# EAGLE design DE0_Expansion (EAGLE 6.5.0)
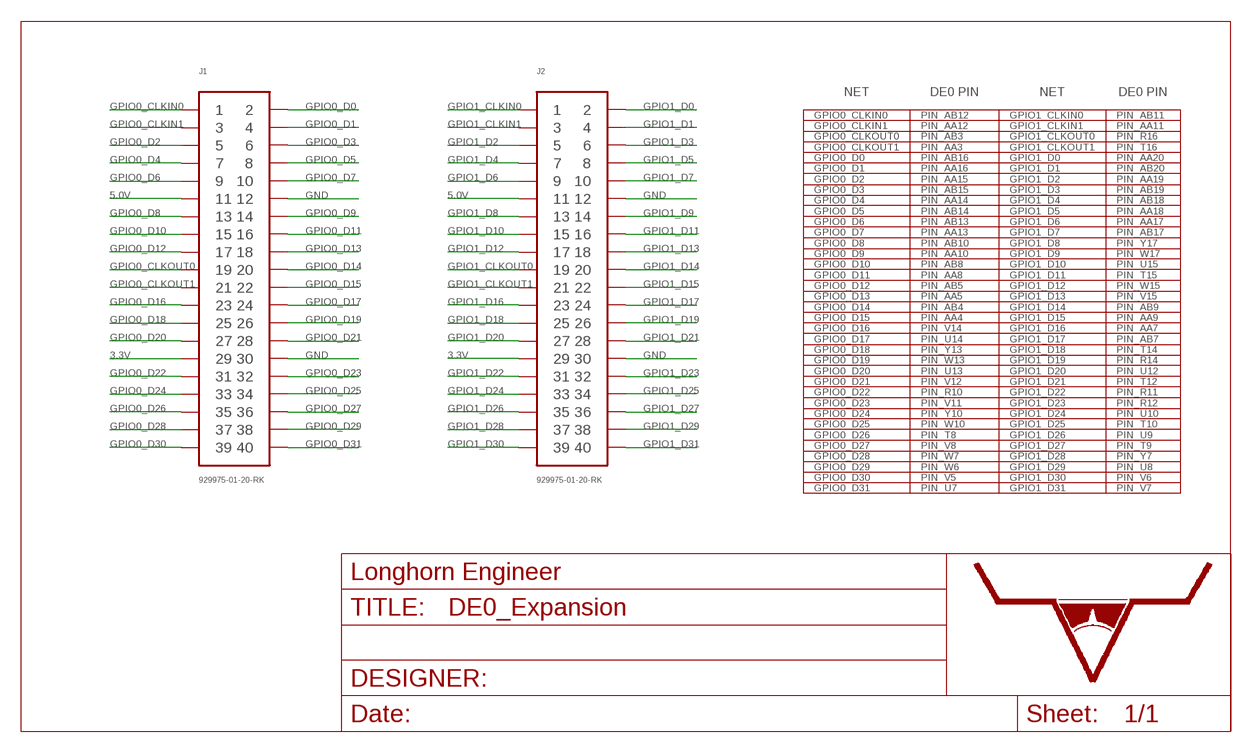
[diagram p0: schematic, sheet 1]

## Parts
FRAME  LHE_FRAME  [LHE_FRAME]
J1  929975-01-20-RK  PH_2X20HEADER_02X20_PTH  [HEADER_02X20_PTH]
J2  929975-01-20-RK  PH_2X20HEADER_02X20_PTH  [HEADER_02X20_PTH]

## Nets
3.3V: J1.29 J2.29
5.0V: J1.11 J2.11
GND: J1.12 J1.30 J2.12 J2.30
GPIO0_CLKIN0: J1.1
GPIO0_CLKIN1: J1.3
GPIO0_CLKOUT0: J1.19
GPIO0_CLKOUT1: J1.21
GPIO0_D0: J1.2
GPIO0_D1: J1.4
GPIO0_D2: J1.5
GPIO0_D3: J1.6
GPIO0_D4: J1.7
GPIO0_D5: J1.8
GPIO0_D6: J1.9
GPIO0_D7: J1.10
GPIO0_D8: J1.13
GPIO0_D9: J1.14
GPIO0_D10: J1.15
GPIO0_D11: J1.16
GPIO0_D12: J1.17
GPIO0_D13: J1.18
GPIO0_D14: J1.20
GPIO0_D15: J1.22
GPIO0_D16: J1.23
GPIO0_D17: J1.24
GPIO0_D18: J1.25
GPIO0_D19: J1.26
GPIO0_D20: J1.27
GPIO0_D21: J1.28
GPIO0_D22: J1.31
GPIO0_D23: J1.32
GPIO0_D24: J1.33
GPIO0_D25: J1.34
GPIO0_D26: J1.35
GPIO0_D27: J1.36
GPIO0_D28: J1.37
GPIO0_D29: J1.38
GPIO0_D30: J1.39
GPIO0_D31: J1.40
GPIO1_CLKIN0: J2.1
GPIO1_CLKIN1: J2.3
GPIO1_CLKOUT0: J2.19
GPIO1_CLKOUT1: J2.21
GPIO1_D0: J2.2
GPIO1_D1: J2.4
GPIO1_D2: J2.5
GPIO1_D3: J2.6
GPIO1_D4: J2.7
GPIO1_D5: J2.8
GPIO1_D6: J2.9
GPIO1_D7: J2.10
GPIO1_D8: J2.13
GPIO1_D9: J2.14
GPIO1_D10: J2.15
GPIO1_D11: J2.16
GPIO1_D12: J2.17
GPIO1_D13: J2.18
GPIO1_D14: J2.20
GPIO1_D15: J2.22
GPIO1_D16: J2.23
GPIO1_D17: J2.24
GPIO1_D18: J2.25
GPIO1_D19: J2.26
GPIO1_D20: J2.27
GPIO1_D21: J2.28
GPIO1_D22: J2.31
GPIO1_D23: J2.32
GPIO1_D24: J2.33
GPIO1_D25: J2.34
GPIO1_D26: J2.35
GPIO1_D27: J2.36
GPIO1_D28: J2.37
GPIO1_D29: J2.38
GPIO1_D30: J2.39
GPIO1_D31: J2.40

## Notes on the sheet
- NET | DE0 PIN | NET | DE0 PIN
- GPIO0_CLKIN0
  GPIO0_CLKIN1
  GPIO0_CLKOUT0
  GPIO0_CLKOUT1
  GPIO0_D0
  GPIO0_D1
  GPIO0_D2
  GPIO0_D3
  GPIO0_D4
  GPIO0_D5
  GPIO0_D6
  GPIO0_D7
  GPIO0_D8
  GPIO0_D9
  GPIO0_D10
  GPIO0_D11
  GPIO0_D12
  GPIO0_D13
  GPIO0_D14
  GPIO0_D15
  GPIO0_D16
  GPIO0_D17
  GPIO0_D18
  GPIO0_D19
  GPIO0_D20
  GPIO0_D21
  GPIO0_D22
  GPIO0_D23
  GPIO0_D24
  GPIO0_D25
  GPIO0_D26
  GPIO0_D27
  GPIO0_D28
  GPIO0_D29
  GPIO0_D30
  GPIO0_D31
- PIN_AB12
  PIN_AA12
  PIN_AB3
  PIN_AA3
  PIN_AB16
  PIN_AA16
  PIN_AA15
  PIN_AB15
  PIN_AA14
  PIN_AB14
  PIN_AB13
  PIN_AA13
  PIN_AB10
  PIN_AA10
  PIN_AB8
  PIN_AA8
  PIN_AB5
  PIN_AA5
  PIN_AB4
  PIN_AA4
  PIN_V14
  PIN_U14
  PIN_Y13
  PIN_W13
  PIN_U13
  PIN_V12
  PIN_R10
  PIN_V11
  PIN_Y10
  PIN_W10
  PIN_T8
  PIN_V8
  PIN_W7
  PIN_W6
  PIN_V5
  PIN_U7
- GPIO1_CLKIN0
  GPIO1_CLKIN1
  GPIO1_CLKOUT0
  GPIO1_CLKOUT1
  GPIO1_D0
  GPIO1_D1
  GPIO1_D2
  GPIO1_D3
  GPIO1_D4
  GPIO1_D5
  GPIO1_D6
  GPIO1_D7
  GPIO1_D8
  GPIO1_D9
  GPIO1_D10
  GPIO1_D11
  GPIO1_D12
  GPIO1_D13
  GPIO1_D14
  GPIO1_D15
  GPIO1_D16
  GPIO1_D17
  GPIO1_D18
  GPIO1_D19
  GPIO1_D20
  GPIO1_D21
  GPIO1_D22
  GPIO1_D23
  GPIO1_D24
  GPIO1_D25
  GPIO1_D26
  GPIO1_D27
  GPIO1_D28
  GPIO1_D29
  GPIO1_D30
  GPIO1_D31
- PIN_AB11
  PIN_AA11
  PIN_R16
  PIN_T16
  PIN_AA20
  PIN_AB20
  PIN_AA19
  PIN_AB19
  PIN_AB18
  PIN_AA18
  PIN_AA17
  PIN_AB17
  PIN_Y17
  PIN_W17
  PIN_U15
  PIN_T15
  PIN_W15
  PIN_V15
  PIN_AB9
  PIN_AA9
  PIN_AA7
  PIN_AB7
  PIN_T14
  PIN_R14
  PIN_U12
  PIN_T12
  PIN_R11
  PIN_R12
  PIN_U10
  PIN_T10
  PIN_U9
  PIN_T9
  PIN_Y7
  PIN_U8
  PIN_V6
  PIN_V7

## Library data of the parts
FRAME = PP_Aesthetics:LHE_FRAME; DNAME: Parker Dillmann; REVNUM: REV: 0
J1 J2 = PP_Connectors:PH_2X20

## Board
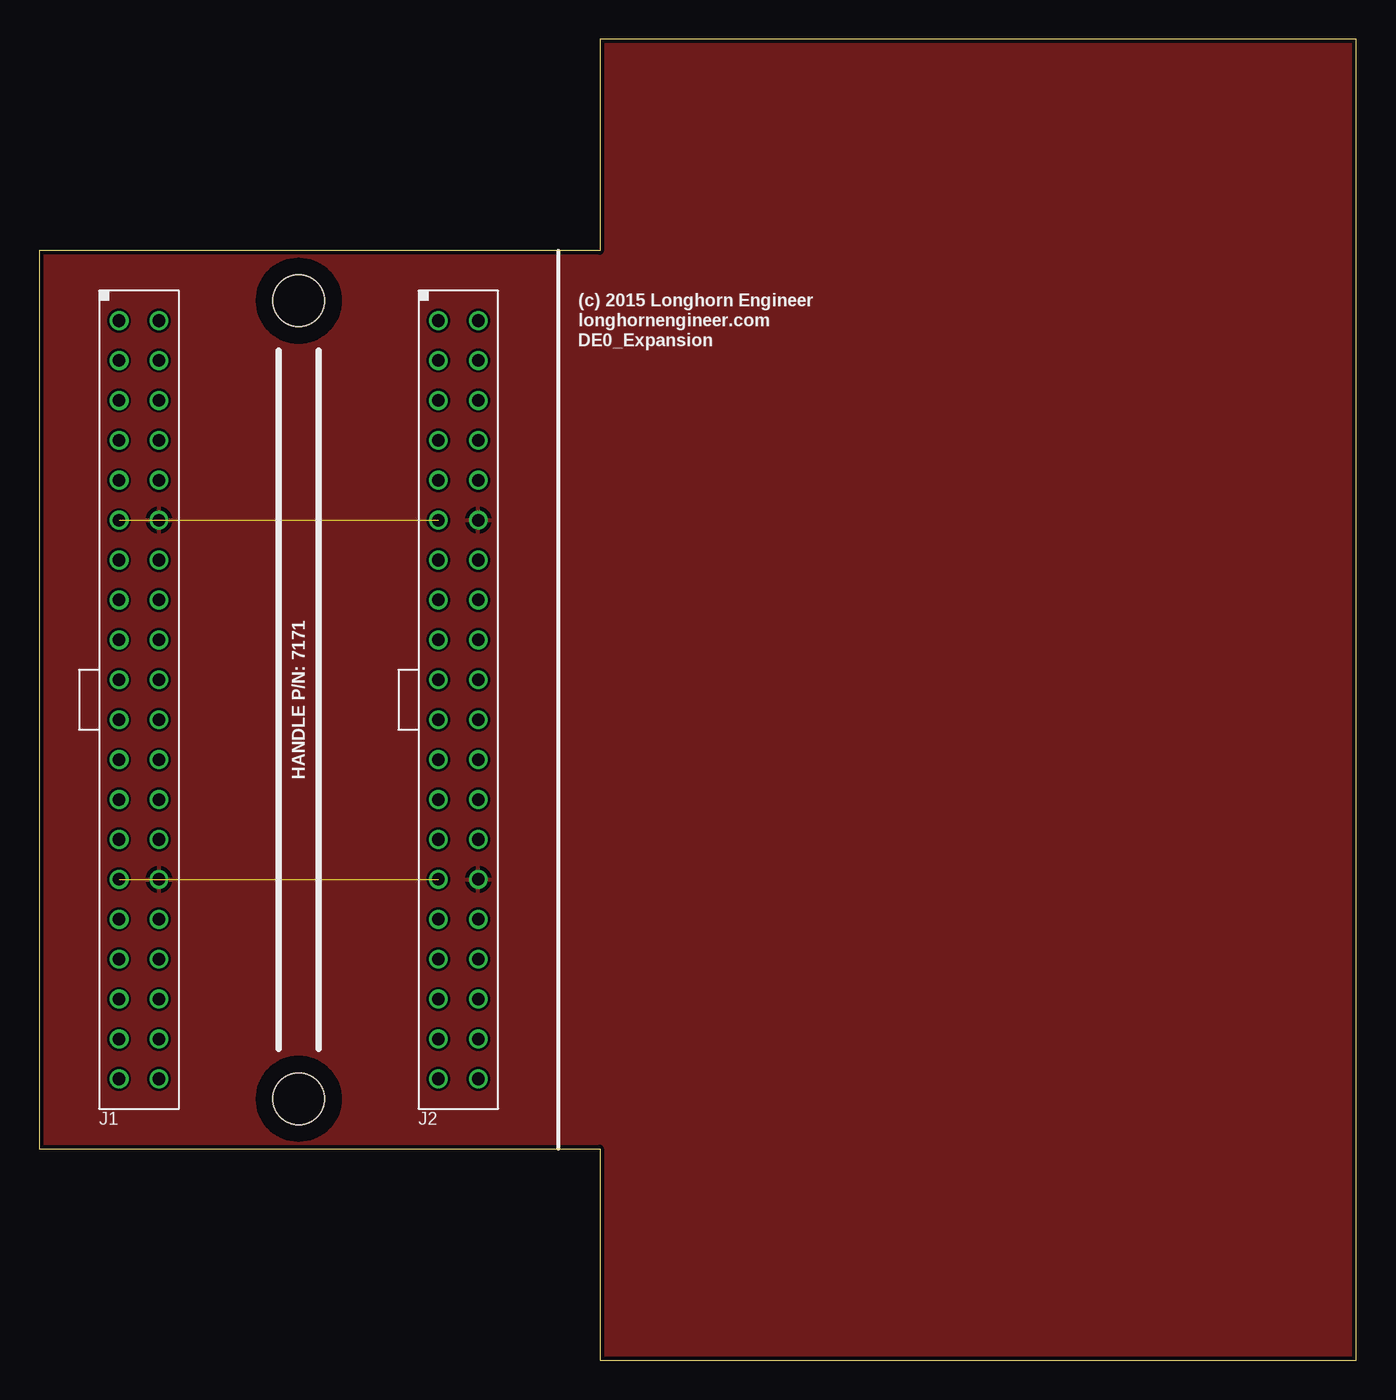
[diagram p1: board, top side]
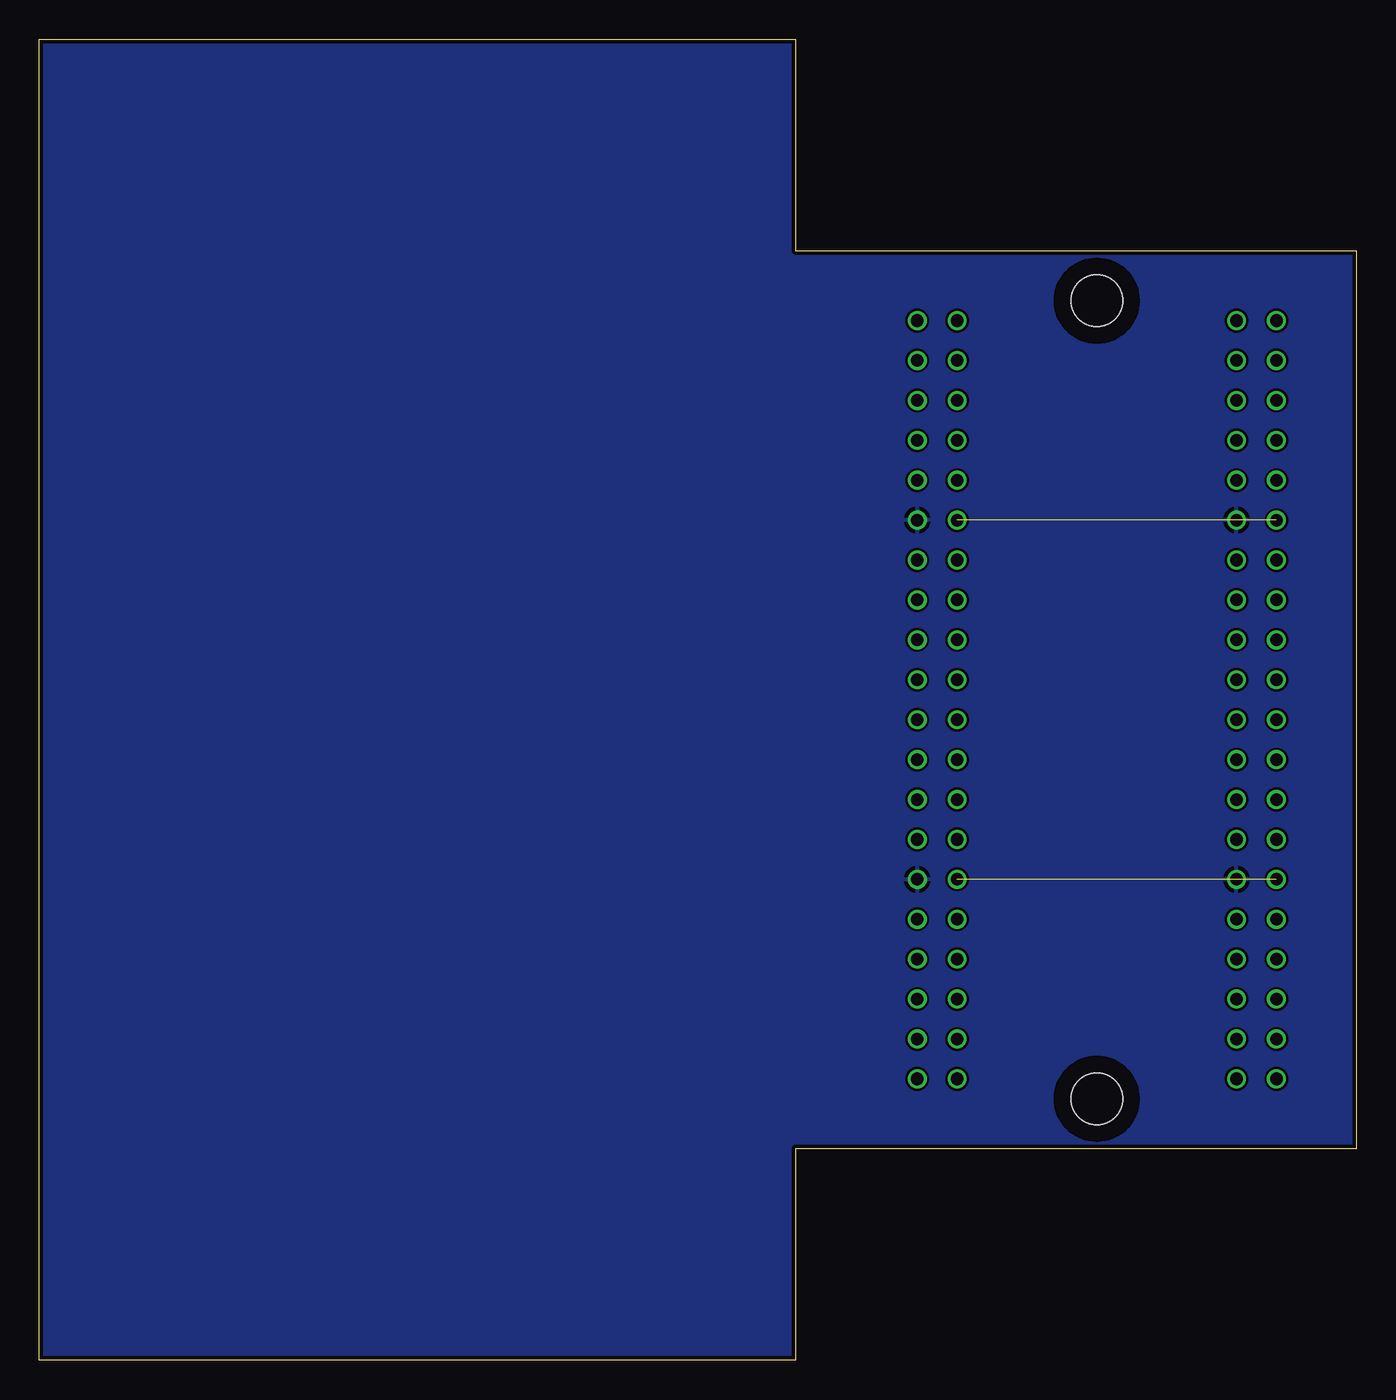
[diagram p2: board, bottom side, seen from below]

Size 83.82 x 84.07 mm. Coordinates in mm from the lower left corner, seen from the top.
Outline: 0,13.46 35.69,13.46 35.69,0 83.82,0 83.82,84.07 35.69,84.07 35.69,70.61 0,70.61 0,13.46
Copper layers (1*16): Top 0.035mm / dielectric 0.2mm / Bottom 0.035mm
Design rules "Seeed_2_Layer_DRU": minimum track width 6mil, minimum drill 12mil, track to track 6mil, track to pad 6mil, pad to pad 6mil, via to via 6mil, smd to smd 0mil, copper to edge 10mil, drill to drill 10mil, minimum pad ring 6mil, minimum via ring 6mil, stop-mask expansion 2mil, vias tented up to drill 25mil, thermal gap 10mil
Holes 3.26 mm at 16.51,67.44 16.51,16.64
tRestrict: area 14,14.1 to 19.1,19.2; area 14,64.9 to 19.1,70
bRestrict: area 14,64.9 to 19.1,70; area 14,14.1 to 19.1,19.2

### Footprints (pad centres in the part's own frame; a part is rotated, then mirrored left to right if it is on the bottom)
HEADER_02X20_PTH = drill 0.8: 1 -1.27,24.13; 2 1.27,24.13; 3 -1.27,21.59; 4 1.27,21.59; 5 -1.27,19.05; 6 1.27,19.05; 7 -1.27,16.51; 8 1.27,16.51; 9 -1.27,13.97; 10 1.27,13.97; 11 -1.27,11.43; 12 1.27,11.43; 13 -1.27,8.89; 14 1.27,8.89; 15 -1.27,6.35; 16 1.27,6.35; 17 -1.27,3.81; 18 1.27,3.81; 19 -1.27,1.27; 20 1.27,1.27; 21 -1.27,-1.27; 22 1.27,-1.27; 23 -1.27,-3.81; 24 1.27,-3.81; 25 -1.27,-6.35; 26 1.27,-6.35; 27 -1.27,-8.89; 28 1.27,-8.89; 29 -1.27,-11.43; 30 1.27,-11.43; 31 -1.27,-13.97; 32 1.27,-13.97; 33 -1.27,-16.51; 34 1.27,-16.51; 35 -1.27,-19.05; 36 1.27,-19.05; 37 -1.27,-21.59; 38 1.27,-21.59; 39 -1.27,-24.13; 40 1.27,-24.13

### Placement (x,y rotation side)
FRAME  34.29,61.98 0 top
J1  6.35,42.04 0 top
J2  26.67,42.04 0 top

### Tracks (layer width: path | path; a pad name or v marks a point on that pad's centre or on a via)
3.3V  (1 unrouted)
5.0V  (1 unrouted)
GND
  pour Top: 83.82,84.07 35.69,84.07 35.69,70.61 0,70.61 0,13.46 35.69,13.46 35.69,0 83.82,0
  pour Bottom: 83.82,84.07 35.69,84.07 35.69,70.61 0,70.61 0,13.46 35.69,13.46 35.69,0 83.82,0

### Text on the board
tPlace: HANDLE P/N: 7171
Document: EDGE OF DE0 FPGA BOARD